# EAGLE design MRDT0003A2 (EAGLE 6.2)
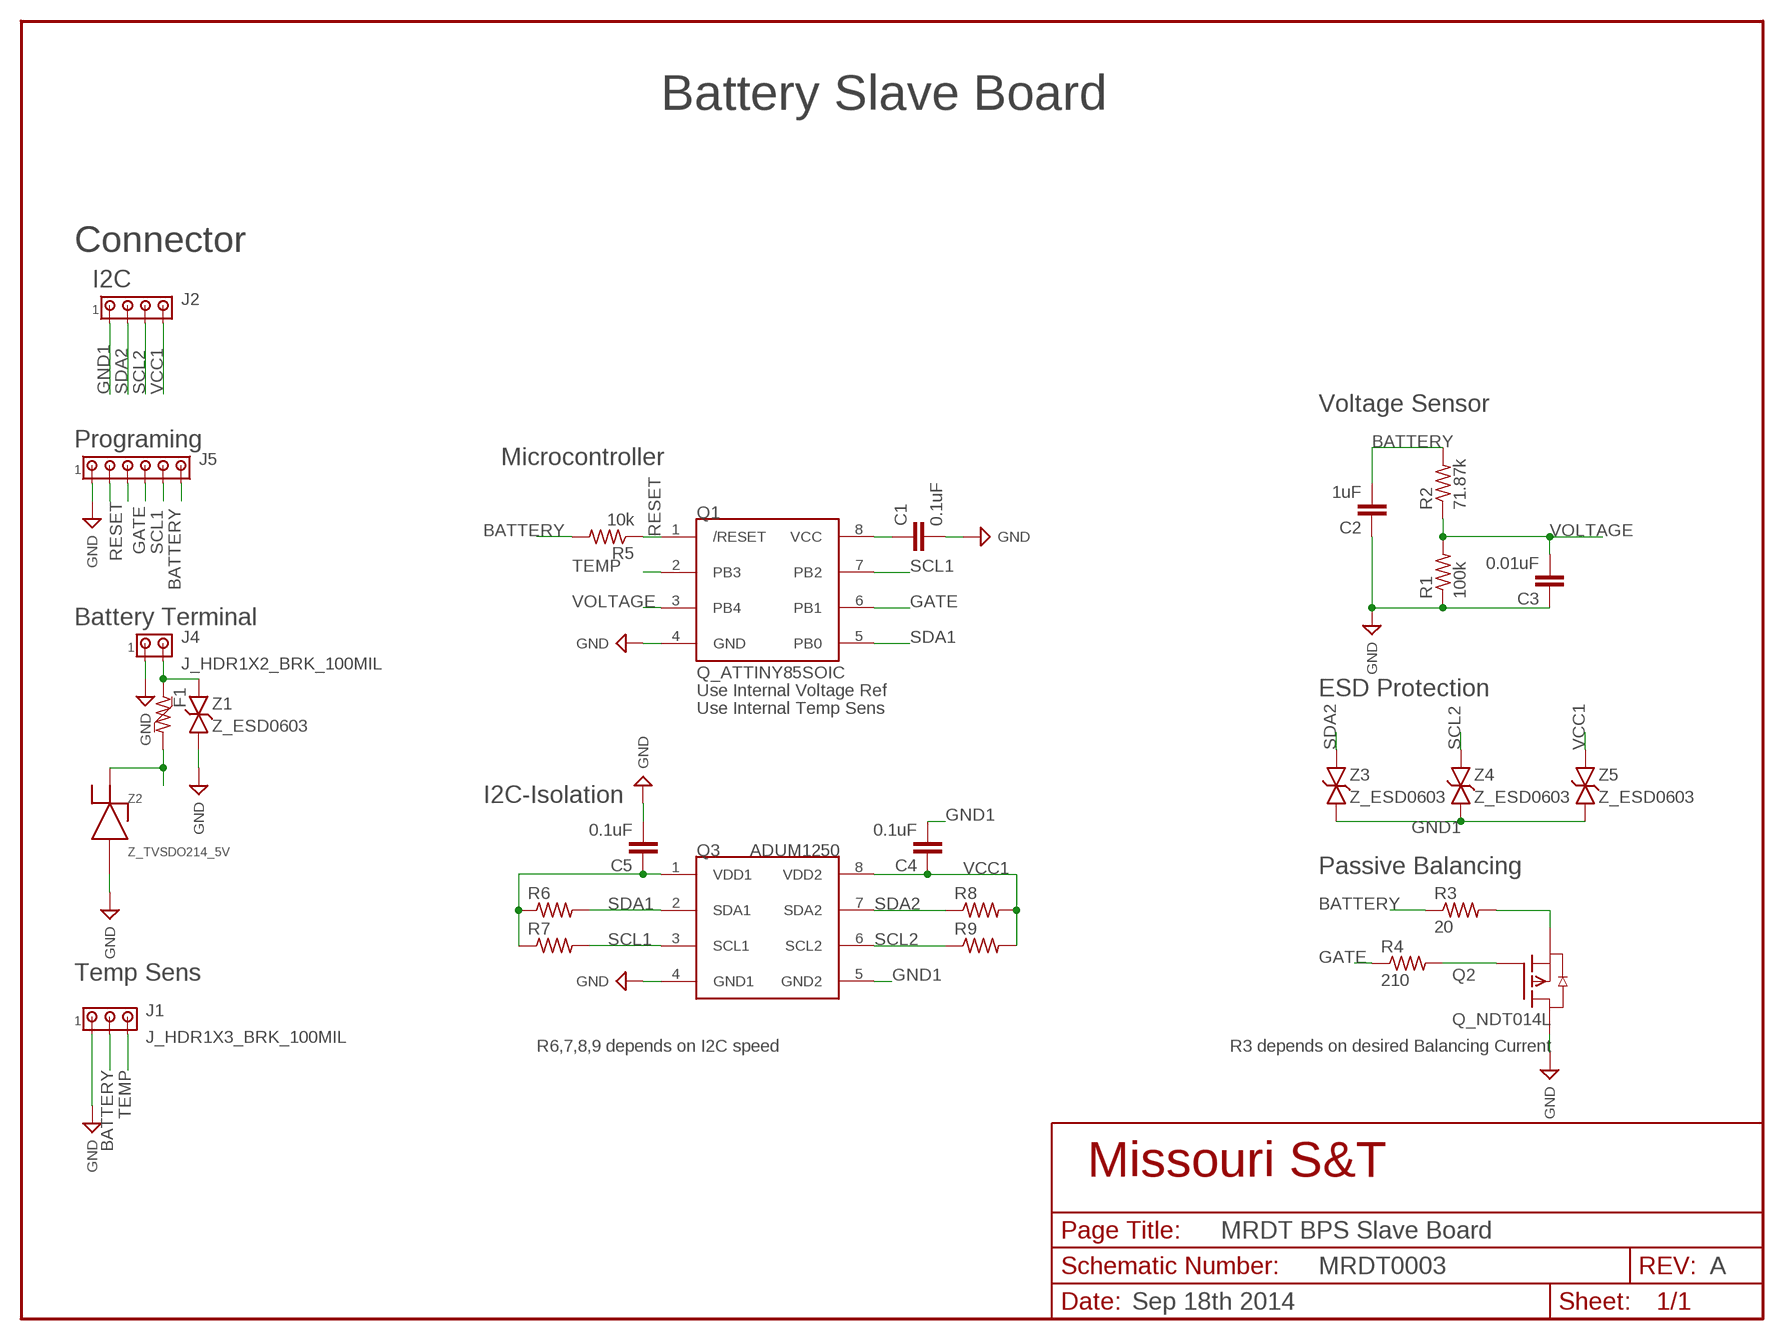
[diagram p0: schematic, sheet 1]

## Parts
C1  0.1uF  C_CAP_0805  [C_0805]
C2  1uF  C_CAP_0805  [C_0805]
C3  0.01uF  C_CAP_0805  [C_0805]
C4  0.1uF  C_CAP_0805  [C_0805]
C5  0.1uF  C_CAP_0805  [C_0805]
F1  R_RES_1210  [R_1210]
J1  J_HDR1X3_BRK_100MIL  [J_BRK1X3_100MIL]
J2  J_HDR1X4_BRK_100MIL  [J_BRK1X4_100MIL]
J4  J_HDR1X2_BRK_100MIL  [J_BRK1X2_100MIL]
J5  J_HDR1X6_BRK_100MIL  [J_BRK1X6_100MIL]
Q1  Q_ATTINY85SOIC  [SOIC8]
Q2  Q_NDT014L  Q_BSP315P  [SOT-223]
Q3  ADUM1250  Q_ADUM1250SOIC  [SOIC8]
R1  100k  R_RES_0805  [R_0805]
R2  71.87k  R_RES_0805  [R_0805]
R3  20  R_RES_2010  [R_2010]
R4  210  R_RES_0805  [R_0805]
R5  10k  R_RES_0805  [R_0805]
R6  R_RES_0805  [R_0805]
R7  R_RES_1206  [R_1206]
R8  R_RES_1206  [R_1206]
R9  R_RES_1206  [R_1206]
Z1  Z_ESD0603  [0603]
Z2  Z_TVSDO214_5V  Z_TVSDO214  [DO-214AC]
Z3  Z_ESD0603  [0603]
Z4  Z_ESD0603  [0603]
Z5  Z_ESD0603  [0603]

## Nets
BATTERY: C1.1 C2.2 C5.1 F1.2 J1.2 J5.6 Q1.8(VCC) Q3.1(VDD1) R2.2 R3.1 R5.2 R6.1 R7.1 Z2.C
GATE: J5.3 Q1.6(PB1) R4.1
GND: C1.2 C2.1 C3.1 C5.2 J1.1 J4.1 J5.1 Q1.4(GND) Q2.2(D) Q3.4(GND1) R1.1 Z1.1 Z2.A ; supply symbol labelled SUP_GND
GND1: C4.2 J2.1 Q3.5(GND2) Z3.1 Z4.1 Z5.1
N$1: F1.1 J4.2 Z1.2
N$2: Q2.1(G) R4.2
N$6: Q2.3(S) R3.2
RESET: J5.2 Q1.1(/RESET) R5.1
SCL1: J5.4 Q1.7(PB2) Q3.3(SCL1) R7.2
SCL2: J2.3 Q3.6(SCL2) R9.1 Z4.2
SDA1: J5.5 Q1.5(PB0) Q3.2(SDA1) R6.2
SDA2: J2.2 Q3.7(SDA2) R8.1 Z3.2
TEMP: J1.3 Q1.2(PB3)
VCC1: C4.1 J2.4 Q3.8(VDD2) R8.2 R9.2 Z5.2
VOLTAGE: C3.2 Q1.3(PB4) R1.2 R2.1

## Notes on the sheet
- Battery Slave Board
- Connector
- I2C
- Voltage Sensor
- Programing
- Microcontroller
- Battery Terminal
- Use Internal Voltage Ref | ESD Protection
- Use Internal Temp Sens
- I2C-Isolation
- ADUM1250
- Passive Balancing
- Temp Sens
- R6,7,8,9 depends on I2C speed | R3 depends on desired Balancing Current
- MRDT BPS Slave Board
- MRDT0003 | A
- Sep 18th 2014

## Library data of the parts
C1-C5 = Lib_Passive:C_CAP
F1 R1-R9 = Lib_Passive:R_RES
J1 = Lib_Electromechanical:J_HDR1X3
J2 = Lib_Electromechanical:J_HDR1X4: AMP connector
J4 = Lib_Electromechanical:J_HDR1X2
J5 = Lib_Electromechanical:J_HDR1X6: AMP connector
Q1 = Master:Q_ATTINY85: ATTINY85 - MCU, 8bit, 20Mhz, SPI, I2C, PWM, ADC
Q2 = PCB0M1:Q_BSP315P
Q3 = Master:Q_ADUM1250: Isolator for I2C communication
Z1 Z3-Z5 = Master:Z_ESD
Z2 = Master:Z_TVS: Generic TVS Diode

## Board
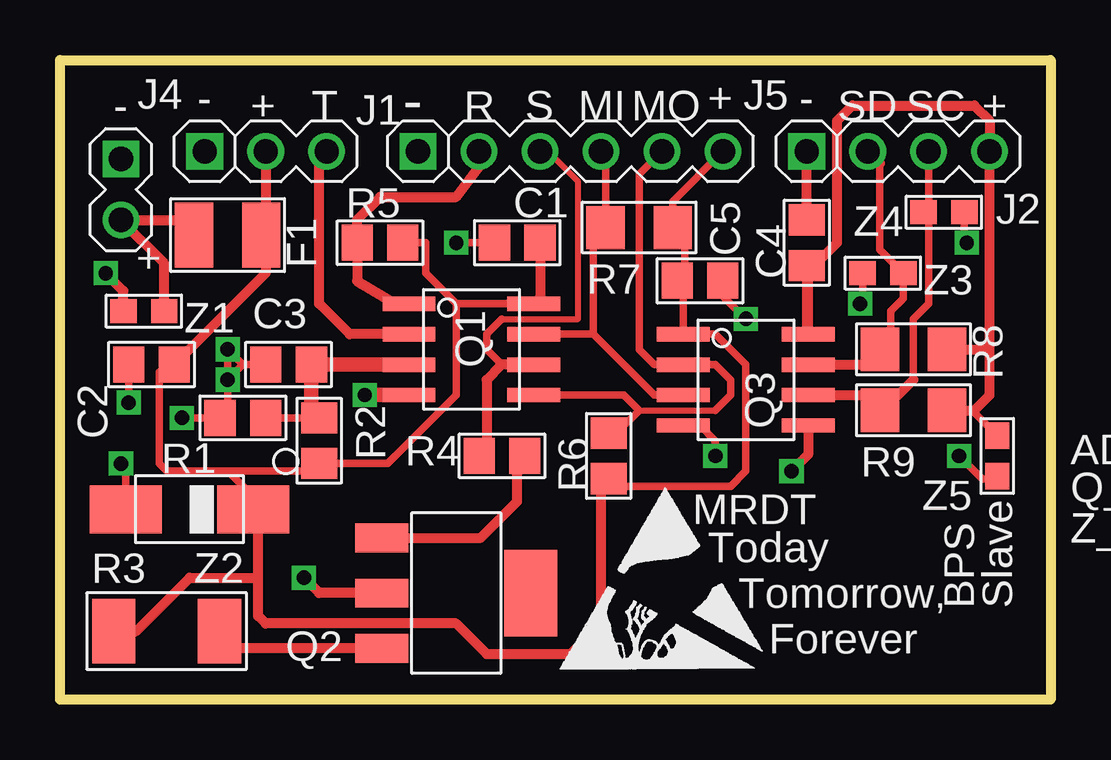
[diagram p1: board, top side]
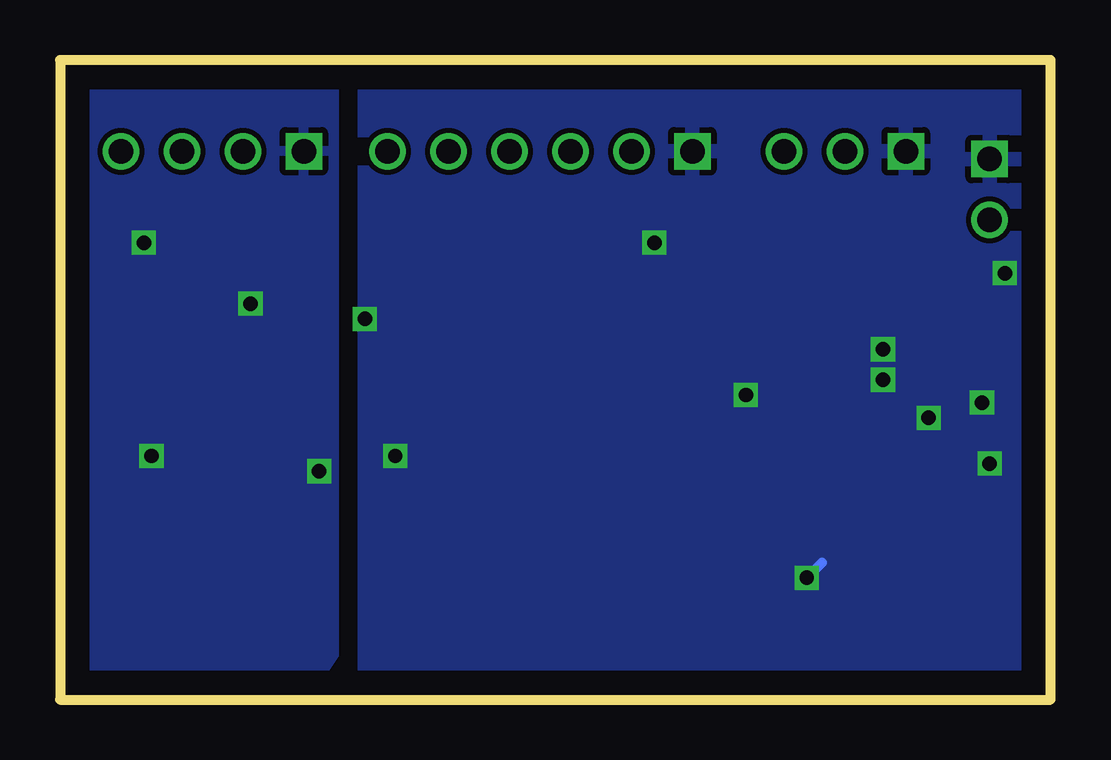
[diagram p2: board, bottom side, seen from below]

Size 41.27 x 26.67 mm. Coordinates in mm from the lower left corner, seen from the top.
Outline: 0,0 0,26.67 41.28,26.67 41.28,0 0,0
Copper layers (1*16): Top 0.035mm / dielectric 1.5mm / Bottom 0.035mm
Design rules: minimum track width 10mil, minimum drill 23mil, track to track 8mil, track to pad 8mil, pad to pad 8mil, via to via 8mil, smd to smd 8mil, copper to edge 40mil, drill to drill 8mil, minimum pad ring 10mil, minimum via ring 8mil, stop-mask expansion 4mil, vias tented up to drill 0mil, thermal gap 10mil

### Footprints (pad centres in the part's own frame; a part is rotated, then mirrored left to right if it is on the bottom)
C_0805 = smd 1.3 x 1.5: 1 -0.95,0; 2 0.95,0
R_1210 = smd 1.6 x 2.7: 1 -1.4,0; 2 1.4,0
J_BRK1X3_100MIL = drill 1.016 square: 1 2.54,0 | drill 1.016: 2 0,0; 3 -2.54,0
J_BRK1X4_100MIL = drill 1.016 square: 1 3.81,0 | drill 1.016: 2 1.27,0; 3 -1.27,0; 4 -3.81,0
J_BRK1X2_100MIL = drill 1.016 square: 1 1.27,0 | drill 1.016: 2 -1.27,0
J_BRK1X6_100MIL = drill 1.016 square: 1 6.35,0 | drill 1.016: 2 3.81,0; 3 1.27,0; 4 -1.27,0; 5 -3.81,0; 6 -6.35,0
SOIC8 = smd 2.2 x 0.6: 1 -2.6,1.905; 2 -2.6,0.635; 3 -2.6,-0.635; 4 -2.6,-1.905; 5 2.6,-1.905; 6 2.6,-0.635; 7 2.6,0.635; 8 2.6,1.905
SOT-223 = smd 1.2 x 2.2: 1 -2.3,-3.1; 2 0,-3.1; 3 2.3,-3.1 | smd 3.6 x 2.2: 4 0,3.1
R_0805 = smd 1.3 x 1.5: 1 -0.95,0; 2 0.95,0
R_2010 = smd 1.8 x 2.7: 1 -2.2,0; 2 2.2,0
R_1206 = smd 1.6 x 1.8: 1 -1.4,0; 2 1.4,0
0603 = smd 1.1 x 1: 1 -0.85,0; 2 0.85,0
DO-214AC = smd 3 x 2: A 2.65,0; C -2.65,0

### Placement (x,y rotation side)
C1  19.05,19.05 180 top
C2  3.81,13.97 0 top
C3  9.52,13.97 0 top
C4  31.12,19.05 90 top
C5  26.67,17.46 0 top
F1  6.98,19.37 0 top
J1  8.57,22.86 180 top
J2  34.92,22.86 180 top
J4  2.54,21.27 90 top
J5  21.27,22.86 180 top
Q1  17.14,14.61 0 top
Q2  16.51,4.45 270 top
Q3  28.57,13.34 0 top
R1  7.62,11.75 0 top
R2  10.79,10.79 270 top
R3  4.45,2.86 0 top
R4  18.41,10.16 0 top
R5  13.33,19.05 0 top
R6  22.86,10.16 90 top
R7  24.13,19.68 180 top
R8  35.56,14.61 0 top
R9  35.56,12.07 0 top
Z1  3.49,16.19 0 top
Z2  5.4,7.94 180 top
Z3  34.29,17.78 0 top
Z4  36.83,20.32 180 top
Z5  39.05,10.16 90 top

### Tracks (layer width: path | path; a pad name or v marks a point on that pad's centre or on a via)
BATTERY
  Top 0.305: 16.51,16.51 15.24,17.78 15.24,19.05 R5.2 | 16.51,16.51 Q1.8 | 16.51,16.51 16.51,12.7 13.65,9.85 R2.2 10.47,9.53 6.99,9.53 | J5.6 25.53,20.77 R7.1 26.04,19.18 26.04,17.78 C5.1 25.98,17.21 Q3.1 27.31,15.24 28.57,13.97 28.57,9.53 27.94,8.89 23.18,8.89 R6.1 | 6.99,9.53 8.05,8.46 Z2.C 8.25,7.73 8.25,7.3 | 6.99,9.53 4.45,9.53 4.13,9.84 4.13,13.66 C2.2
  Top 0.406: Q1.8 20,16.77 C1.1 | J1.2 8.57,19.55 F1.2 8.57,19.18 8.57,17.78 C2.2 | 8.25,5.08 8.25,3.49 8.57,3.18 16.51,3.18 17.78,1.9 21.27,1.9 22.54,3.18 22.54,8.89 R6.1 | 8.25,5.08 8.25,7.3 | R3.1 3.18,2.86 5.4,5.08 8.25,5.08
GATE
  Top 0.254: 18.42,15.88 21.59,15.88 21.59,21.59 20.32,22.86 J5.3
  Top 0.305: 18.42,13.97 17.78,14.61 17.78,15.24 18.42,15.88
  Top 0.406: Q1.6 18.42,13.97 17.78,13.34 17.78,10.47 R4.1
GND  (via drill 0.6)
  Top 0.305: C1.2 v16.51,19.05 | 7.62,13.97 v6.99,14.61 6.99,12.06 R1.1 v5.08,11.75 | C3.1 7.62,13.97 | 7.62,13.97 v6.99,13.34 | Q3.4 26.67,11.43 27.31,10.79 v27.31,10.16 | C5.2 27.62,16.83 v28.57,15.88 | C2.1 v2.86,12.38 | Z2.A 2.75,9.63 v2.54,9.84
  Top 0.406: Q2.2 10.79,4.45 v10.16,5.08 | Z1.1 2.64,17.04 v1.9,17.78
  Top 0.61: Q1.4 v12.7,12.7
  Bottom 0.406: v10.16,5.08 9.53,5.71
  pour Bottom: 0,26.67 0,0 28.57,0 28.57,26.67
GND1  (via drill 0.6)
  Top 0.305: Z4.1 37.68,19.15 v37.78,19.05 | Z3.1 33.44,16.61 v33.34,16.51 | v37.46,10.16 38.42,9.21 38.95,9.21 Z5.1
  Top 0.406: C4.2 J2.1 | Q3.5 31.17,10.22 v30.48,9.53
  pour Bottom: 29.84,25.4 31.12,26.67 38.73,26.67 40.01,25.4 40.01,0 31.12,0 29.84,1.9
N$1
  Top 0.406: F1.1 4.95,20 J4.2 4.34,18.2 Z1.2
N$2
  Top 0.406: 19.45,10.08 R4.2 19.05,9.85 19.05,8.26 17.54,6.75 Q2.1
N$6
  Top 0.406: Q2.3 7.06,2.15 6.99,2.22 6.99,2.52 R3.2
RESET
  Top 0.406: Q1.1 13.97,16.51 12.39,17.46 R5.1 12.39,20 13.33,20.96 16.51,20.96 17.46,22.23 J5.2
SCL1
  Top 0.305: Q3.3 24.76,12.7 22.22,15.24 | J5.4 22.73,22.67 R7.2 22.22,19.18 22.22,15.24 | Q1.7 22.22,15.24
SCL2
  Top 0.305: 35.56,13.34 35.56,15.88 36.2,16.51 36.2,20.11 Z4.2 36.2,20.54 J2.3
  Top 0.406: Q3.6 33.53,12.7 | 33.53,12.7 R9.1 | 33.53,12.7 34.92,12.7 35.56,13.34
SDA1
  Top 0.254: 24.13,12.07 27.31,12.07
  Top 0.305: Q1.5 23.5,12.7 24.13,12.07 23.17,11.11 R6.2 | 27.31,12.07 27.94,12.7 27.94,13.34 27.31,13.97 Q3.2 24.76,13.97 24.13,14.61 24.13,21.91 J5.5
SDA2
  Top 0.305: 34.16,22.36 34.16,18.76 Z3.2 35.14,16.73 34.61,16.19 34.61,15.05 R8.1
  Top 0.406: Q3.7 33.53,13.97 R8.1 | 34.16,22.36 J2.2
TEMP
  Top 0.406: Q1.2 12.07,15.24 10.79,16.51 10.79,22.54 J1.3
VCC1
  Top 0.305: 38.1,12.07 38.1,11.96 Z5.2
  Top 0.406: R8.2 38.73,14.61 | 38.73,14.61 J2.4 38.73,24.13 38.1,24.77 33.02,24.77 32.39,24.13 32.39,19.05 31.75,18.41 31.12,18.41 31.17,18.36 Q3.8 31.12,15.3 C4.1 | R9.2 38.1,12.07 38.73,12.7 38.73,14.61
VOLTAGE
  Top 0.305: C3.2 10.47,11.75 R1.2
  Top 0.61: Q1.3 C3.2 10.47,12.07 R2.1

### Text on the board
tPlace: - | + | - | - | + | T | - | R | S | MI | MO | SD | SC | + | + | MRDT | Today | Tomorrow, | BPS | Slave | Forever